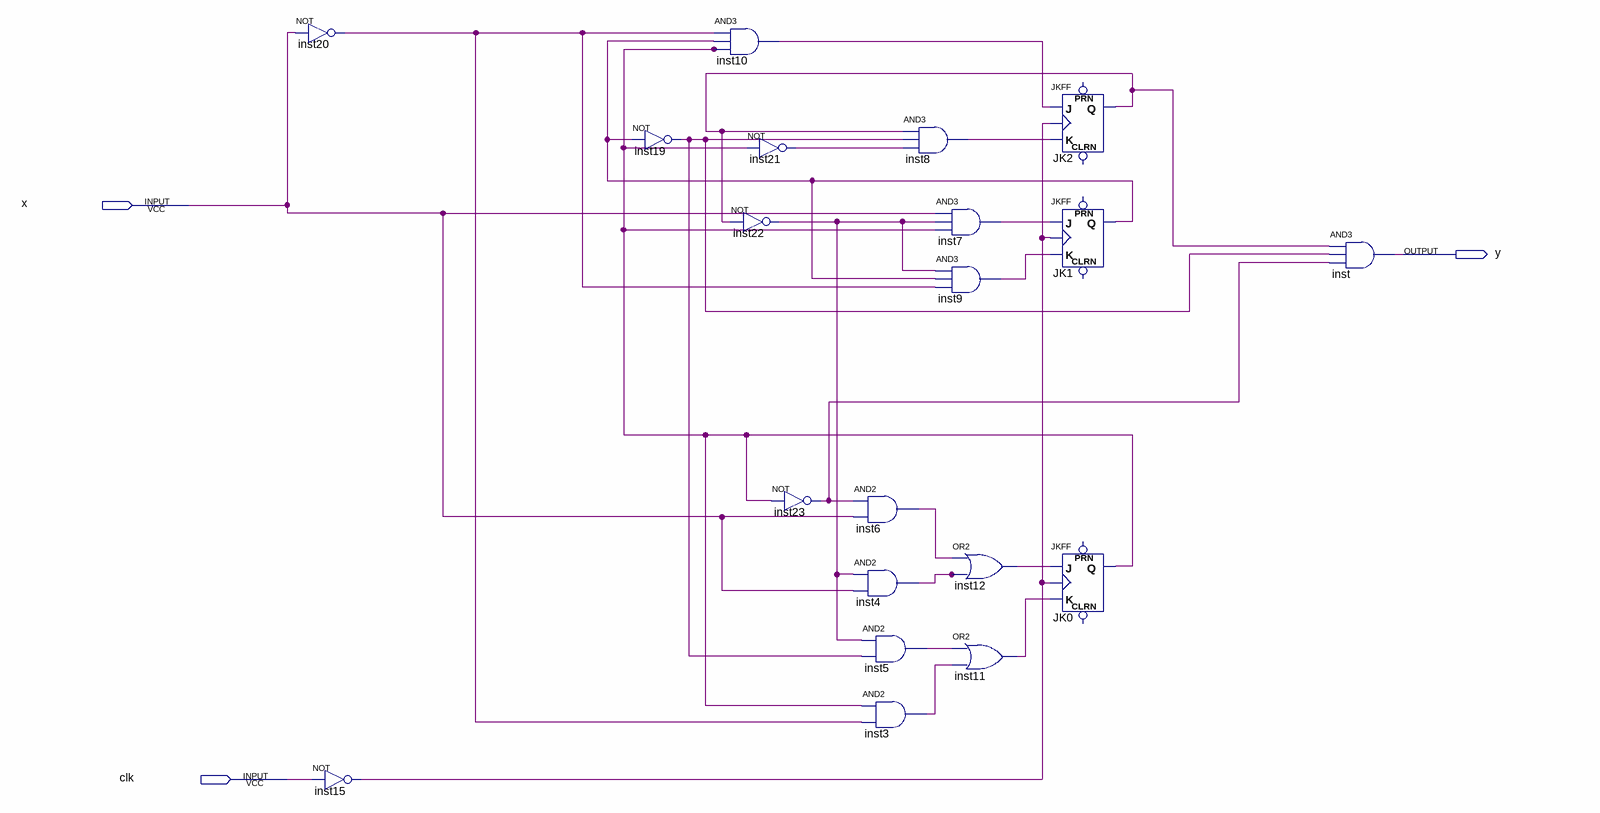
[diagram p0: schematic sheet]
// Quartus schematic state_moore_BLOCK.bdf as structural Verilog: 20 symbols, 3 pins
module state_moore_BLOCK (
  input  x,
  input  clk,
  output y
);

  wire inst3_out, inst4_out, inst5_out, inst6_out, inst7_out, inst8_out, inst9_out, inst10_out, inst11_out,
       inst12_out, inst15_out, inst19_out, inst20_out, inst21_out, inst22_out, inst23_out, JK0_q, JK1_q,
       JK2_q;

  not inst20 (inst20_out, x);
  not inst15 (inst15_out, clk);
  not inst19 (inst19_out, JK1_q);
  and inst10 (inst10_out, inst20_out, JK1_q, JK0_q);
  not inst21 (inst21_out, JK0_q);
  not inst22 (inst22_out, JK2_q);
  not inst23 (inst23_out, JK0_q);
  and inst6 (inst6_out, inst23_out, x);
  and inst4 (inst4_out, inst22_out, x);
  and inst8 (inst8_out, JK2_q, inst19_out, inst21_out);
  and inst5 (inst5_out, inst22_out, inst19_out);
  and inst3 (inst3_out, JK0_q, inst20_out);
  and inst7 (inst7_out, x, inst22_out, JK0_q);
  and inst9 (inst9_out, inst22_out, JK1_q, inst20_out);
  or inst12 (inst12_out, inst6_out, inst4_out);
  or inst11 (inst11_out, inst5_out, inst3_out);
  JKFF JK2 (.K(inst8_out), .J(inst10_out), .CLK(inst15_out), .Q(JK2_q));  // open: PRN, CLRN
  JKFF JK1 (.K(inst9_out), .J(inst7_out), .CLK(inst15_out), .Q(JK1_q));  // open: PRN, CLRN
  JKFF JK0 (.K(inst11_out), .J(inst12_out), .CLK(inst15_out), .Q(JK0_q));  // open: PRN, CLRN
  and inst (y, JK2_q, inst19_out, inst23_out);
endmodule
